# EAGLE design 555_ckt (EAGLE 9.5.1)
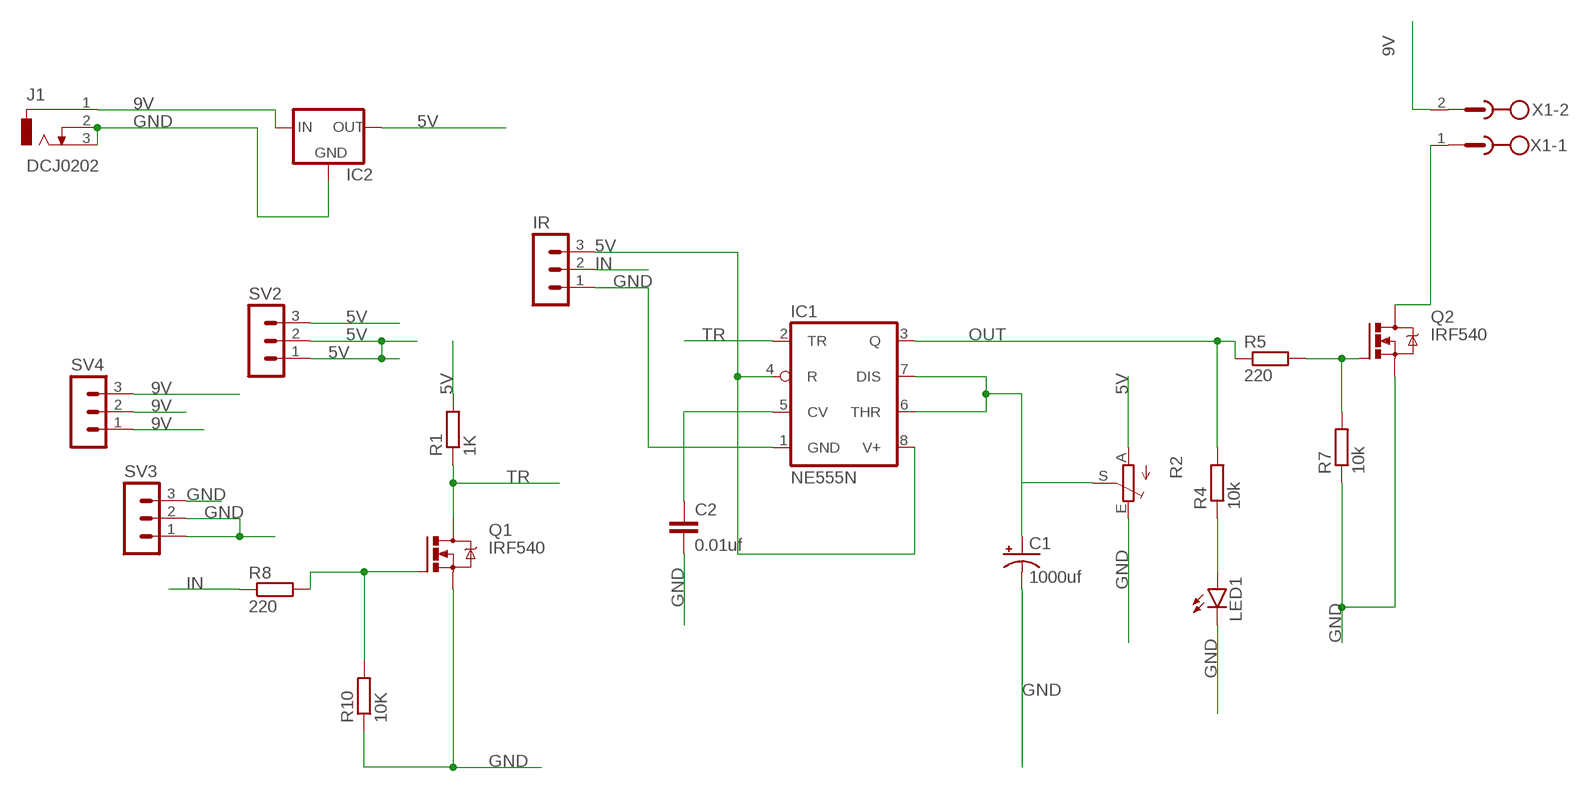
[diagram p0: schematic, sheet 1]

## Parts
C1  1000uf  CPOL-USE2.5-7  [E2,5-7]
C2  0.01uf  C-EU025-024X044  [C025-024X044]
IC1  NE555N  [DIL08]
IC2  78XXL  [78XXL]
IR  MA03-1  [MA03-1]
J1  DCJ0202  [DCJ0202]
LED1  LED3MM  [LED3MM]
Q1  IRF540  [TO220BV]
Q2  IRF540  [TO220BV]
R1  1K  R-EU_0207/10  [0207/10]
R2  TRIM_EU-B64Y  [B64Y]
R4  10k  R-EU_0207/10  [0207/10]
R5  220  R-EU_0207/10  [0207/10]
R7  10k  R-EU_0207/10  [0207/10]
R8  220  R-EU_0207/10  [0207/10]
R10  10K  R-EU_0207/10  [0207/10]
SV2  MA03-1  [MA03-1]
SV3  MA03-1  [MA03-1]
SV4  MA03-1  [MA03-1]
X1  MSTBV2  [MSTBV2]

## Nets
5V: IC1.4(R) IC1.8(V+) IC2.OUT IR.3 R1.2 R2.A SV2.1 SV2.2 SV2.3
9V: IC2.IN J1.1 SV4.1 SV4.2 SV4.3 X1.2
GND: C1.- C2.2 IC1.1(GND) IC2.GND IR.1 J1.2 J1.3 LED1.K(C) Q1.S Q2.S R2.E R7.1 R10.1 SV3.1 SV3.2 SV3.3
IN: IR.2 R8.1
N$2: C2.1 IC1.5(CV)
N$3: Q1.G R8.2 R10.2
N$5: C1.+ IC1.6(THR) IC1.7(DIS) R2.S
N$6: Q2.G R5.2 R7.2
N$7: LED1.A R4.1
N$8: Q2.D X1.1
OUT: IC1.3(Q) R4.2 R5.1
TR: IC1.2(TR) Q1.D R1.1

## Library data of the parts
C1 = rcl:CPOL-US: POLARIZED CAPACITOR, American symbol; SPICEPREFIX: C
C2 = rcl:C-EU: CAPACITOR, European symbol; SPICEPREFIX: C
IC1 = linear4:*555: TIMER
IC2 = v-reg:78XXL: VOLTAGE REGULATOR
IR SV2-SV4 = con-lstb:MA03-1: PIN HEADER; OC_FARNELL: unknown; OC_NEWARK: unknown
J1 = con-jack:DCJ0202: DC POWER JACK Source: DCJ0202.pdf; OC_FARNELL: unknown; OC_NEWARK: unknown
LED1 = led:LED: LED OSRAM: - CHIPLED LG R971, LG N971, LY N971, LG Q971, LY Q971, LO R971, LY R971 LH N974, LH R974 LS Q976, LO Q976, LY Q976 LO Q996 - Hyper CHIPLED LW Q18S LB Q993, LB Q99A, LB R99A - SideLED LS A670, LO A670, LY A670, LG A670, LP A670 LB A673, LV A673, LT A673, LW A673 LH A674 LY A675 LS A676, LA A676, LO A676, LY A676, LW A676 LS A679, LY A679, LG A679 - Hyper Micro SIDELED® LS Y876, LA Y876, LO Y876, LY Y876 LT Y87S - SmartLED LW L88C, LW L88S LB L89C, LB L89S, LG L890 LS L89K, LO L89K, LY L89K LS L896, LA L896, LO L896, LY L896 - TOPLED LS T670, LO T670, LY T670, LG T670, LP T670 LSG T670, LSP T670, LSY T670, LOP T670, LYG T670 LG T671, LOG T671, LSG T671 LB T673, LV T673, LT T673, LW T673 LH T674 LS T676, LA T676, LO T676, LY T676, LB T676, LH T676, LSB T676, LW T676 LB T67C, LV T67C, LT T67C, LS T67K, LO T67K, LY T67K, LW E67C LS E67B, LA E67B, LO E67B, LY E67B, LB E67C, LV E67C, LT E67C LW T67C LS T679, LY T679, LG T679 LS T770, LO T770, LY T770, LG T770, LP T770 LB T773, LV T773, LT T773, LW T773 LH T774 LS E675, LA E675, LY E675, LS T675 LS T776, LA T776, LO T776, LY T776, LB T776 LHGB T686 LT T68C, LB T68C - Hyper Mini TOPLED® LB M676 - Mini TOPLED Santana® LG M470 LS M47K, LO M47K, LY M47K Source: http://www.osram.convergy.de LUXEON: - LUMILED® LXK2-PW12-R00, LXK2-PW12-S00, LXK2-PW14-U00, LXK2-PW14-V00 LXK2-PM12-R00, LXK2-PM12-S00, LXK2-PM14-U00 LXK2-PE12-Q00, LXK2-PE12-R00, LXK2-PE12-S00, LXK2-PE14-T00, LXK2-PE14-U00 LXK2-PB12-K00, LXK2-PB12-L00, LXK2-PB12-M00, LXK2-PB14-N00, LXK2-PB14-P00, LXK2-PB14-Q00 LXK2-PR12-L00, LXK2-PR12-M00, LXK2-PR14-Q00, LXK2-PR14-R00 LXK2-PD12-Q00, LXK2-PD12-R00, LXK2-PD12-S00 LXK2-PH12-R00, LXK2-PH12-S00 LXK2-PL12-P00, LXK2-PL12-Q00, LXK2-PL12-R00 Source: www.luxeon.com KINGBRIGHT: KA-3528ASYC Source: www.kingbright.com
Q1 Q2 = transistor-power:IRF540: HEXFET Power MOSFET
R1 R4 R5 R7 R8 R10 = rcl:R-EU_: RESISTOR, European symbol; SPICEPREFIX: R
R2 = pot:TRIM_EU-: POTENTIOMETER
X1 = con-phoenix-500:MSTBV2: PHOENIX; OC_FARNELL: unknown; OC_NEWARK: unknown

## Board
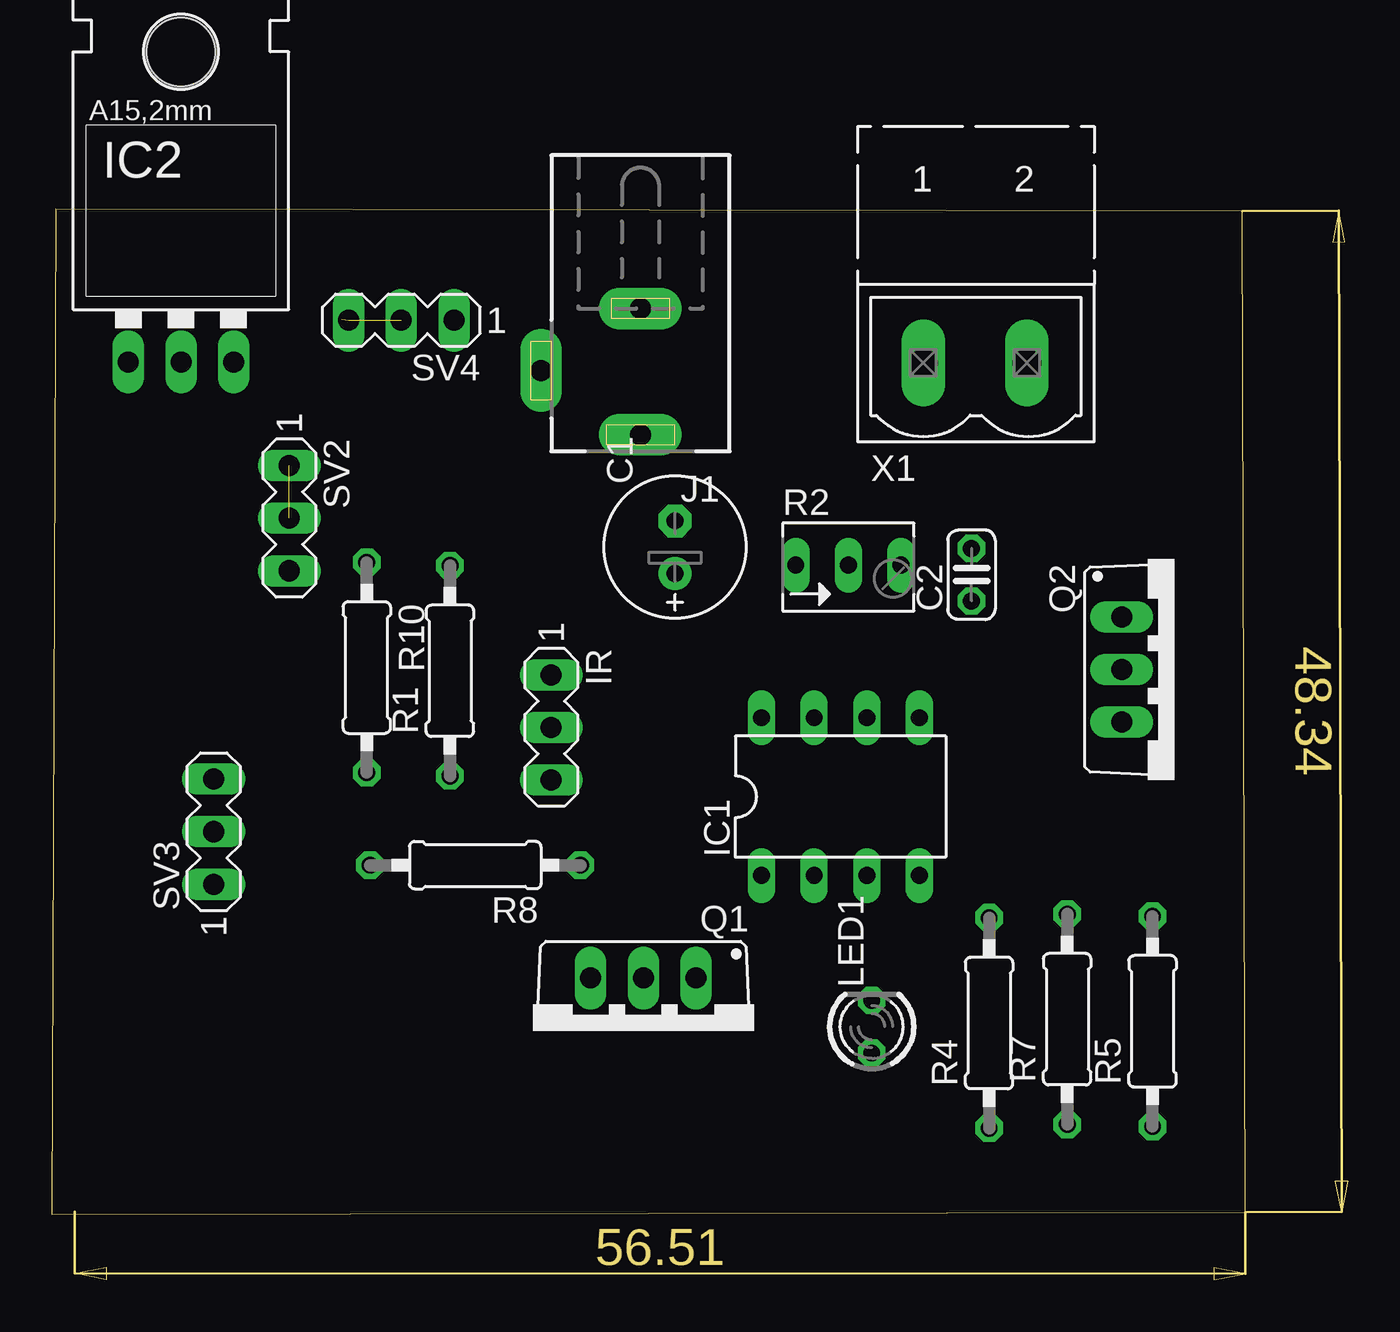
[diagram p1: board, top side]
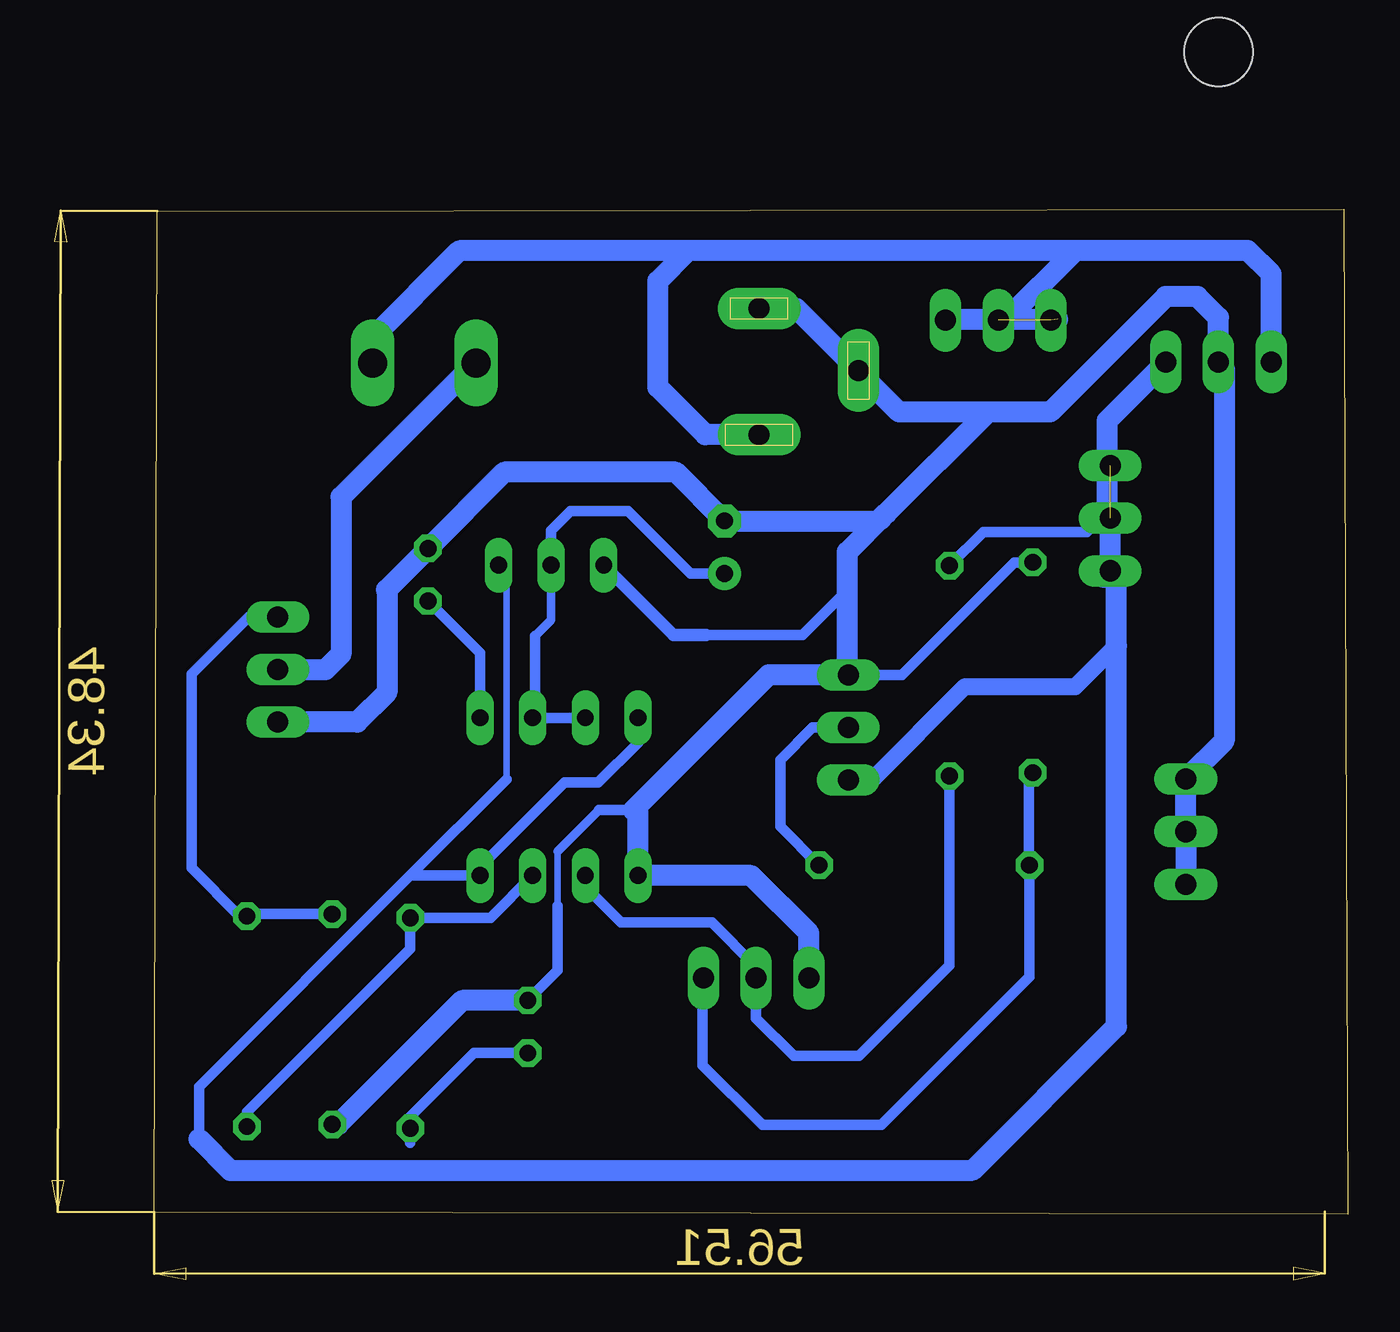
[diagram p2: board, bottom side, seen from below]

Size 57.63 x 48.56 mm. Coordinates in mm from the lower left corner, seen from the top.
Outline: 0,0 57.63,0.12 57.49,48.46 0.18,48.56 0,0
Copper layers (1*16): Top 0.035mm / dielectric 1.5mm / Bottom 0.035mm
Design rules "default": minimum track width 6mil, minimum drill 0.35mm, track to track 6mil, track to pad 6mil, pad to pad 6mil, via to via 6mil, smd to smd 6mil, copper to edge 40mil, drill to drill 6mil, minimum pad ring 10mil, minimum via ring 8mil, stop-mask expansion 4mil, vias tented up to drill 0mil, thermal gap 10mil

### Footprints (pad centres in the part's own frame; a part is rotated, then mirrored left to right if it is on the bottom)
E2,5-7 = drill 0.813 pad 1.6: + -1.27,0 | drill 0.813 pad 1.6 octagon: - 1.27,0
C025-024X044 = drill 0.813 octagon: 1 -1.27,0; 2 1.27,0
DIL08 = drill 0.813 long: 1 -3.81,-3.81; 2 -1.27,-3.81; 3 1.27,-3.81; 4 3.81,-3.81; 5 3.81,3.81; 6 1.27,3.81; 7 -1.27,3.81; 8 -3.81,3.81
78XXL = drill 1.016 long: GND 0,-3.81; IN -2.54,-3.81; OUT 2.54,-3.81 | hole 3.302: 0,11.176
MA03-1 = drill 1.016 long: 1 -2.54,0; 2 0,0; 3 2.54,0
DCJ0202 = drill 1 pad 2 long: 1 0,3.1; 2 4.8,0; 3 0,-3
LED3MM = drill 0.813 octagon: A -1.27,0; K 1.27,0
TO220BV = drill 1.016 long: D 0,-2.54; G -2.54,-2.54; S 2.54,-2.54
0207/10 = drill 0.813 octagon: 1 -5.08,0; 2 5.08,0
B64Y = drill 0.813 long: A 2.54,0; E -2.54,0; S 0,0
MSTBV2 = drill 1.397 long: 1 -2.5,0; 2 2.5,0

### Placement (x,y rotation side)
C1  30.1,32.23 90 top
C2  44.42,30.9 90 top
IC1  38.09,20.18 0 top
IC2  6.24,44.98 0 top
IR  24.12,23.52 270 top
J1  28.43,40.76 180 top
LED1  39.6,9.07 90 top
Q1  28.57,8.88 180 top
Q2  54.21,26.32 270 top
R1  19.23,26.26 90 top
R2  38.47,31.36 0 top
R4  45.27,9.25 90 top
R5  53.16,9.33 90 top
R7  49.04,9.43 90 top
R8  20.45,16.87 180 top
R10  15.21,26.42 270 top
SV2  11.47,33.63 270 top
SV3  7.82,18.49 90 top
SV4  16.88,43.19 180 top
X1  44.59,41.13 0 top

### Tracks (layer width: path | path; a pad name or v marks a point on that pad's centre or on a via)
5V  (1 unrouted)
  Bottom 0.305: 40.63,30.93 40.63,21.01
  Bottom 0.406: R2.A 41.01,31.31 40.63,30.93
  Bottom 0.508: IC1.8 34.28,22.78 36.2,20.86 37.82,20.86 41.53,17.15 41.53,16.74 IC1.4 45.27,16.37 | R1.2 17.6,32.97 12.61,32.97 11.63,33.95 | 22.99,20.98 IR.3 | 40.63,21.01 45.27,16.37 | 45.27,16.37 55.48,6.17 55.48,3.65
  Bottom 0.813: 11.17,27.48 13.16,25.49 18.48,25.49 22.99,20.98
  Bottom 1.016: IC2.OUT 11.63,38.32 11.63,33.95 11.47,33.79 SV2.2 SV2.3 | SV2.3 11.17,30.79 11.17,27.48 11.17,9.08 18.11,2.14 53.96,2.13 55.48,3.65 | 11.78,30.78 SV2.3
9V  (2 unrouted)
  Bottom 1.016: SV4.1 19.37,43.24 16.48,43.24 | 16.48,43.24 14.01,43.24 | X1.2 47.09,42.36 42.91,46.54 31.86,46.54 | IC2.IN 3.7,45.43 4.83,46.56 13.16,46.56 | 16.48,43.24 13.16,46.56 | 28.27,37.82 J1.1 31.02,37.66 33.32,39.96 33.32,45.08 31.86,46.54 | 13.16,46.56 31.84,46.56 31.86,46.54
GND
  Bottom 0.305: 38.15,17.54 38.15,14.92
  Bottom 0.406: 38.15,17.54 36.16,19.53 | 38.16,14.69 38.16,14.91 38.15,14.92
  Bottom 0.508: 24.11,32.06 24.17,32 | R10.1 16.09,31.5 21.53,26.06 IR.1 | 36.16,19.53 34.5,19.53 | 24.17,30.15 26.33,27.99 31,27.99 32.14,27.99 | 38.16,14.91 38.16,11.78 LED1.K
  Bottom 0.61: R2.E 32.56,27.99 31,27.99
  Bottom 1.016: 34.28,19.75 27.97,26.06 IR.1 24.17,26.11 24.17,30.15 24.17,32 22.3,33.87 22.27,33.87 | 34.28,19.75 34.5,19.53 | Q1.S 26.03,13.59 28.81,16.37 IC1.1 34.28,19.75 | J1.2 23.63,39.45 | 17.38,38.76 14.37,38.76 8.79,44.34 7.26,44.34 6.24,43.32 IC2.GND 5.97,40.9 5.97,22.88 SV3.3 SV3.2 SV3.1 | 17.38,38.76 21.67,38.76 23.63,40.72 J1.2 | J1.2 26.63,43.76 J1.3 | 22.27,33.87 17.38,38.76 | LED1.K 42.76,10.34 48.75,4.35 R7.1 | 46.4,30.19 C2.2 40.74,35.85 32.45,35.85 C1.- 22.64,33.5 22.27,33.87 | 46.4,30.19 46.42,30.17 46.38,30.17 | 46.4,30.19 46.4,25.22 47.84,23.78 Q2.S
IN
  Bottom 0.508: R8.1 27.4,18.74 27.4,21.96 25.84,23.52 IR.2
N$2
  Bottom 0.508: C2.1 41.9,27.11 IC1.5
N$3
  Bottom 0.508: 15.44,21.11 R10.2 15.39,21.16 15.39,16.89 R8.2 15.37,11.49 22.53,4.33 28.27,4.33 31.15,7.21 31.15,11.38 Q1.G
N$5
  Bottom 0.406: 39.25,27.93 38.47,28.71 R2.S
  Bottom 0.508: 39.25,27.93 39.25,24.1 IC1.6 IC1.7 36.76,24.05 | C1.+ 31.74,30.96 34.76,33.98 37.53,33.98 38.47,33.04 R2.S
N$6
  Bottom 0.508: R7.2 53.06,14.51 R5.2 53.51,14.41 55.84,16.74 55.84,26.11 53.09,28.86 Q2.G
N$7
  Bottom 0.508: 45.27,3.47 R4.1 45.27,4.72 42.19,7.8 LED1.A
N$8
  Bottom 1.016: X1.1 42.15,41.13 48.62,34.66 48.62,27.07 49.37,26.32 Q2.D
OUT
  Bottom 0.508: IC1.3 41.4,14.33 R4.2 45.27,12.84 53.16,4.95 R5.1
TR
  Bottom 0.508: IC1.2 36.82,15.83 35.09,14.1 30.71,14.1 28.57,11.96 Q1.D 28.57,9.47 26.75,7.66 23.61,7.66 19.23,12.03 R1.1